# Altium schematic sheet Li_Monitor.SchDoc
size A
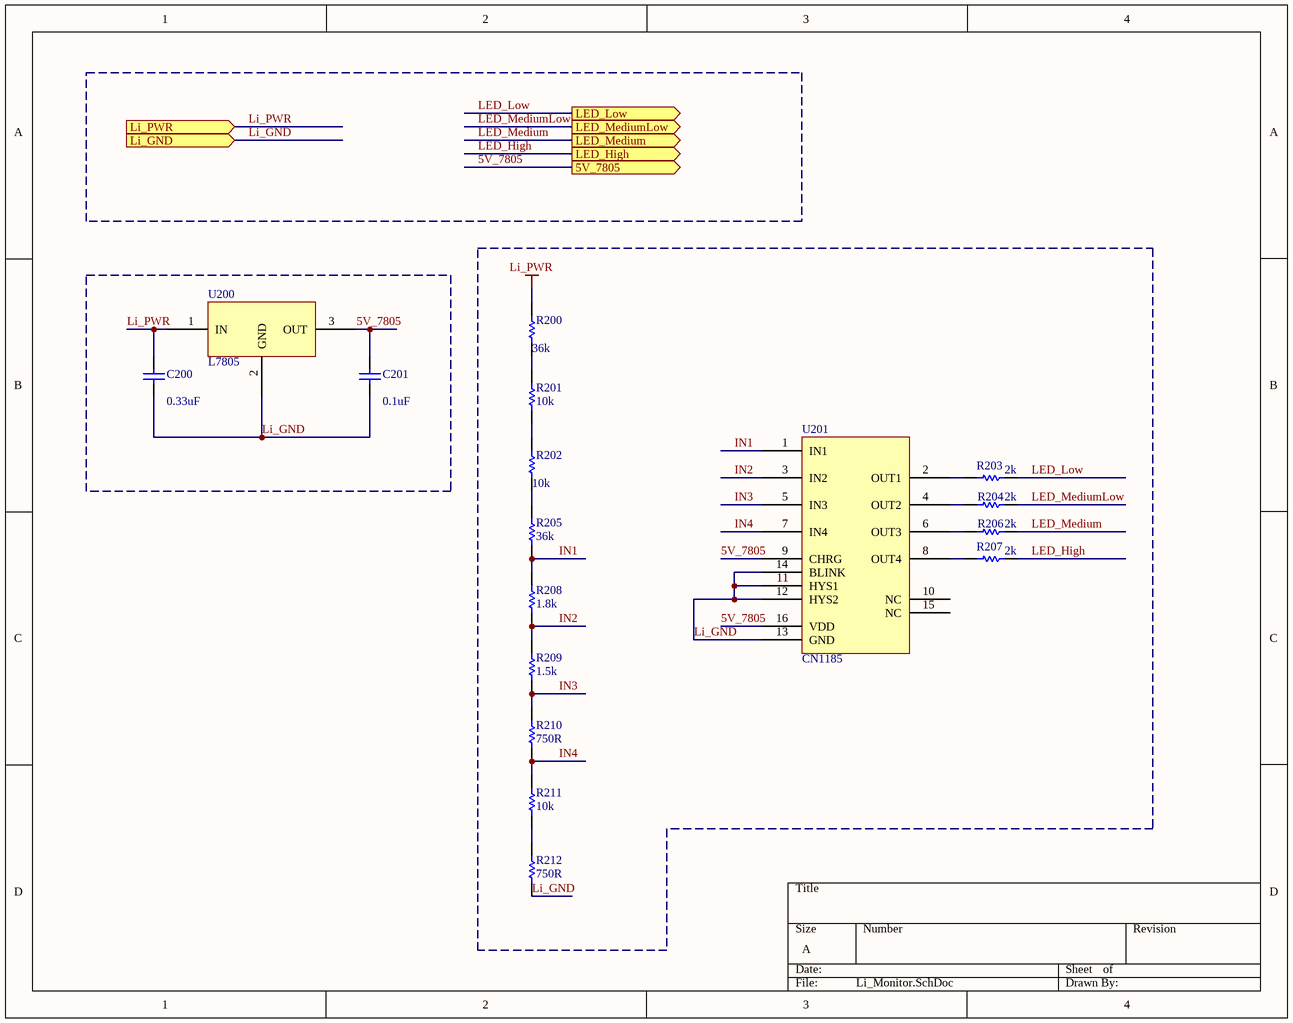
[diagram p0: Li_Monitor.SchDoc]

## Parts
C200  0.33uF  [cap0603]
C201  0.1uF  [cap0603]
R200  36k  [RES0603]
R201  10k  [RES0603]
R202  10k  [RES0603]
R203  2k  [RES0603]
R204  2k  [RES0603]
R205  36k  [RES0603]
R206  2k  [RES0603]
R207  2k  [RES0603]
R208  1.8k  [RES0603]
R209  1.5k  [RES0603]
R210  750R  [RES0603]
R211  10k  [RES0603]
R212  750R  [RES0603]
U200  L7805  [TO-220-AB]
U201  CN1185  [SSOP16_L]

## Ports
5V_7805 (out), LED_High (out), LED_Low (out), LED_Medium (out), LED_MediumLow (out), Li_GND (in), Li_PWR (in)

## Nets
Li_PWR: C200.2 R200.2 U200.1(IN) ; port Li_PWR
5V_7805: C201.2 U200.3(OUT) U201.9(CHRG) U201.16(VDD) ; port 5V_7805
IN1: R205.1 R208.2 U201.1(IN1)
IN2: R208.1 R209.2 U201.3(IN2)
IN3: R209.1 R210.2 U201.5(IN3)
IN4: R210.1 R211.2 U201.7(IN4)
LED_High: R207.2 ; port LED_High
LED_Low: R203.2 ; port LED_Low
LED_Medium: R206.2 ; port LED_Medium
LED_MediumLow: R204.2 ; port LED_MediumLow
Li_GND: C200.1 C201.1 R212.1 U200.2(GND) U201.11(HYS1) U201.12(HYS2) U201.13(GND) U201.14(BLINK) ; port Li_GND
NetR200_1: R200.1 R201.2
NetR201_1: R201.1 R202.2
NetR202_1: R202.1 R205.2
NetR203_1: R203.1 U201.2(OUT1)
NetR204_1: R204.1 U201.4(OUT2)
NetR206_1: R206.1 U201.6(OUT3)
NetR207_1: R207.1 U201.8(OUT4)
NetR211_1: R211.1 R212.2

Not connected (* = marked no-connect by the designer): U201 10(NC) 15(NC)

## Library data of the parts
C200 C201 = Cap: Capacitor; Published: 8-Jun-2000; LatestRevisionDate: 17-Jul-2002; LatestRevisionNote: Re-released for DXP Platform.; PackageReference: RAD-0.3; Publisher: Altium Limited; PackageDescription: Radial Cap, Thru-Hole; 2 Leads; 0.3 in Pin Spacing
  C200: Value: 0.33uF
  C201: Value: 0.1uF
R200-R202 R205 R208-R212 = Res1: Resistor; Published: 8-Jun-2000; LatestRevisionDate: 17-Jul-2002; LatestRevisionNote: Re-released for DXP Platform.; PackageReference: AXIAL-0.3; Publisher: Altium Limited; PackageDescription: Axial Device, Thru-Hole; 2 Leads; 0.3 in Pin Spacing
  R200 R205: Value: 36k
  R201 R202 R211: Value: 10k
  R208: Value: 1.8k
  R209: Value: 1.5k
  R210 R212: Value: 750R
R203 R204 R206 R207 = Res1: Resistor; Value: 10k; Published: 8-Jun-2000; LatestRevisionDate: 17-Jul-2002; LatestRevisionNote: Re-released for DXP Platform.; PackageReference: AXIAL-0.3; Publisher: Altium Limited; PackageDescription: Axial Device, Thru-Hole; 2 Leads; 0.3 in Pin Spacing